# EAGLE design debug-port-breakout (EAGLE 9.6.1)
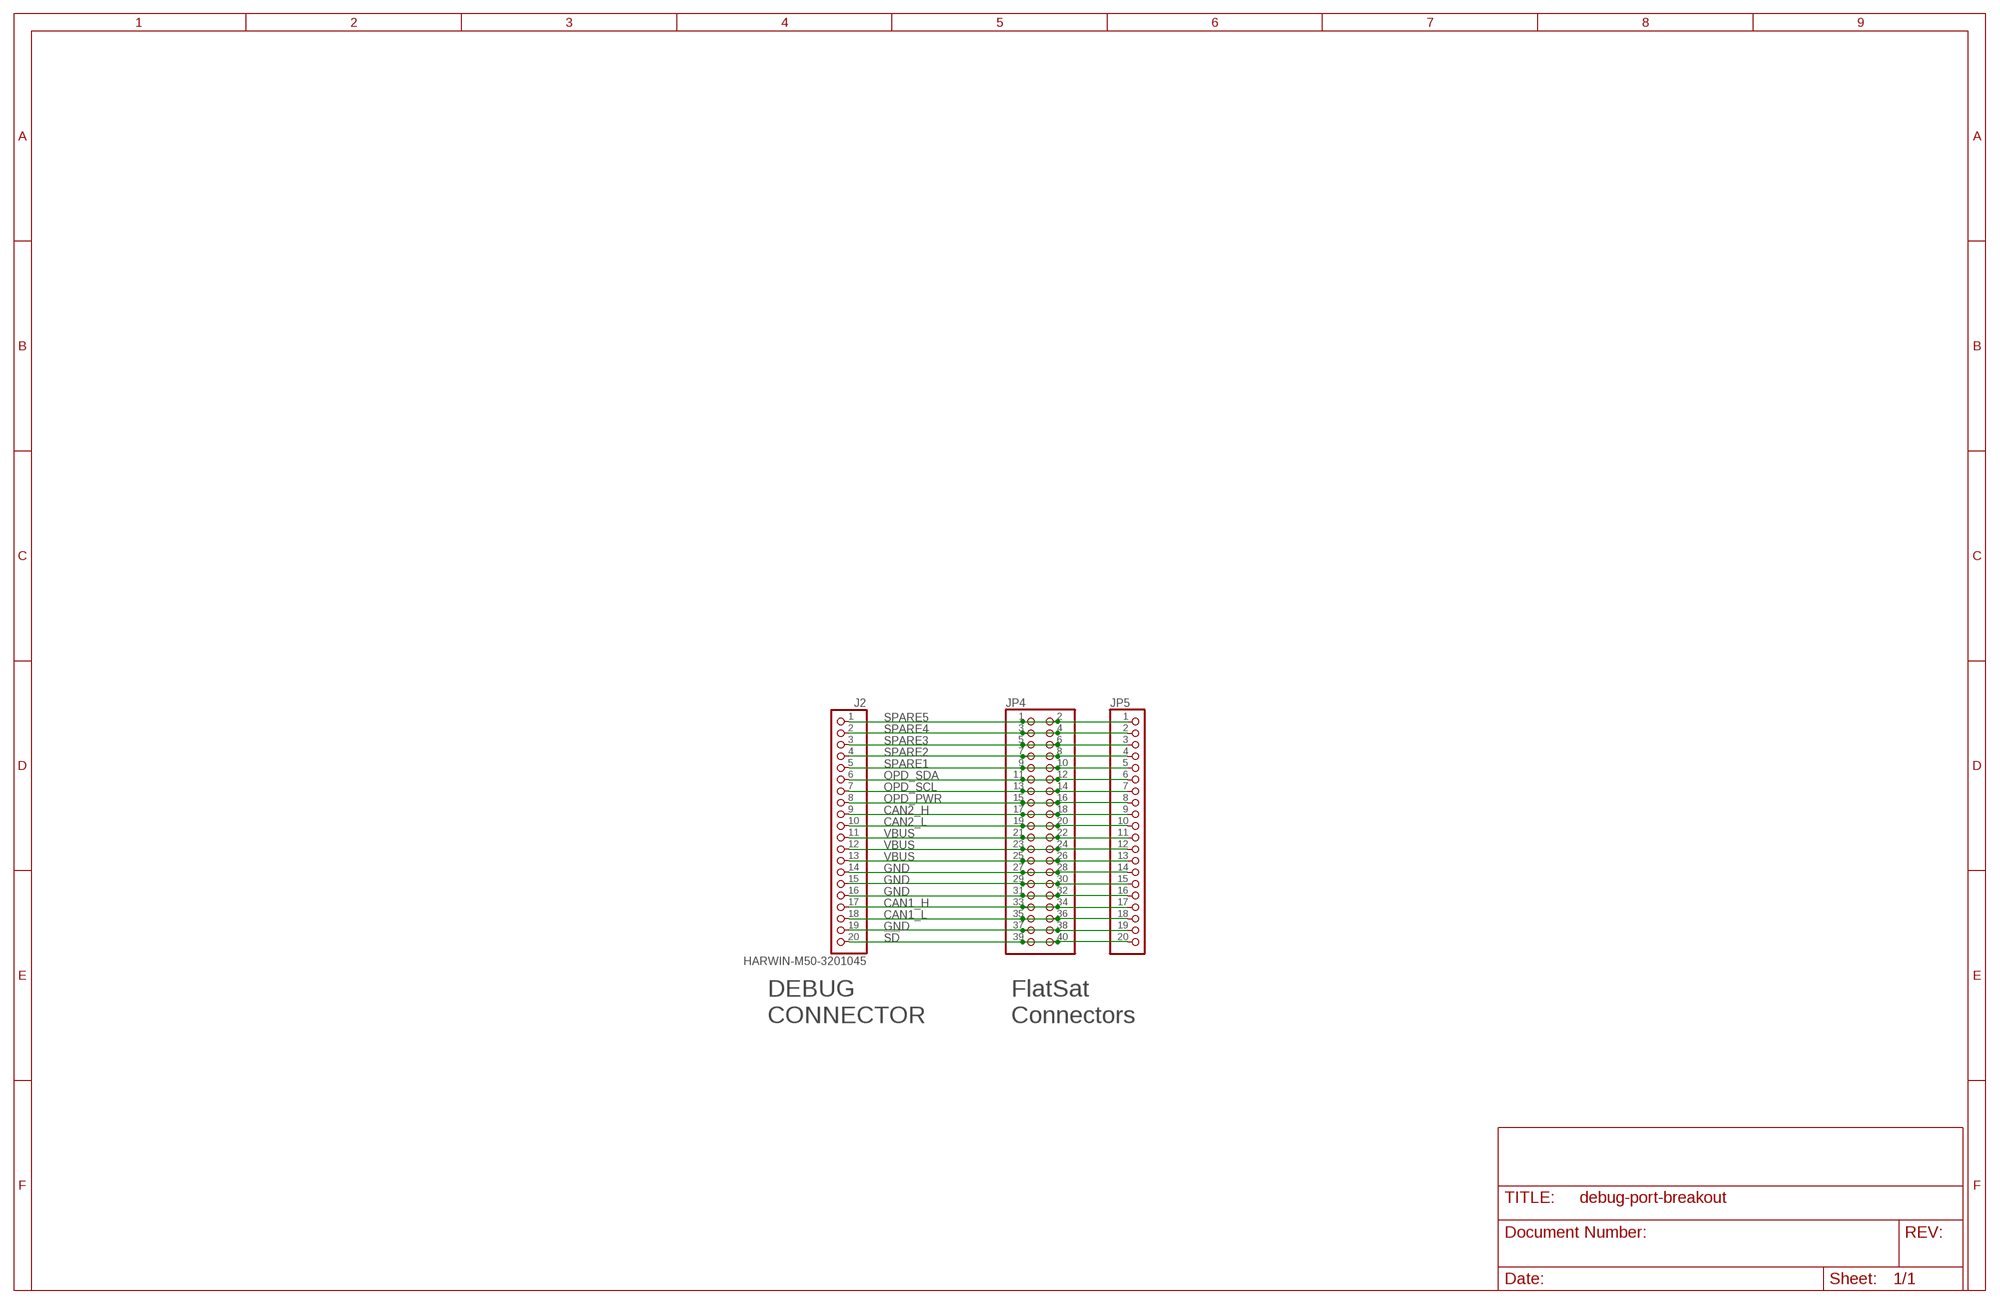
[diagram p0: schematic, sheet 1]

## Parts
J2  HARWIN-M50-3201045  [HARWIN-M50-3201045]
JP4  PINHD-2X20  [2X20]
JP5  PINHD-1X20  [1X20]

## Nets
!SD: J2.20 JP4.39 JP4.40 JP5.20
CAN1_H: J2.17 JP4.33 JP4.34 JP5.17
CAN1_L: J2.18 JP4.35 JP4.36 JP5.18
CAN2_H: J2.9 JP4.17 JP4.18 JP5.9
CAN2_L: J2.10 JP4.19 JP4.20 JP5.10
GND: J2.14 J2.15 J2.16 J2.19 JP4.27 JP4.28 JP4.29 JP4.30 JP4.31 JP4.32 JP4.37 JP4.38 JP5.14 JP5.15 JP5.16 JP5.19
OPD_PWR: J2.8 JP4.15 JP4.16 JP5.8
OPD_SCL: J2.7 JP4.13 JP4.14 JP5.7
OPD_SDA: J2.6 JP4.11 JP4.12 JP5.6
SPARE1: J2.5 JP4.9 JP4.10 JP5.5
SPARE2: J2.4 JP4.7 JP4.8 JP5.4
SPARE3: J2.3 JP4.5 JP4.6 JP5.3
SPARE4: J2.2 JP4.3 JP4.4 JP5.2
SPARE5: J2.1 JP4.1 JP4.2 JP5.1
VBUS: J2.11 J2.12 J2.13 JP4.21 JP4.22 JP4.23 JP4.24 JP4.25 JP4.26 JP5.11 JP5.12 JP5.13

## Notes on the sheet
- DEBUG
  CONNECTOR
- FlatSat
  Connectors

## Library data of the parts
J2 = J-Harwin-M50-3201045-20pin-1.27-F-right-angle-th:HARWIN-M50-3201045
JP4 = pinhead:PINHD-2X20: PIN HEADER
JP5 = pinhead:PINHD-1X20: PIN HEADER

## Board
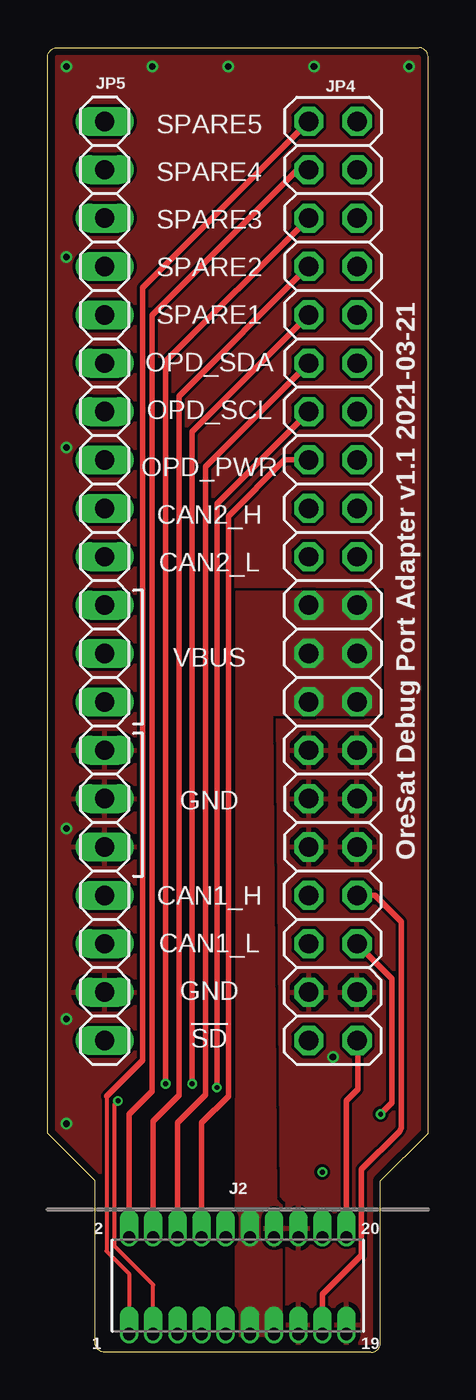
[diagram p1: board, top side]
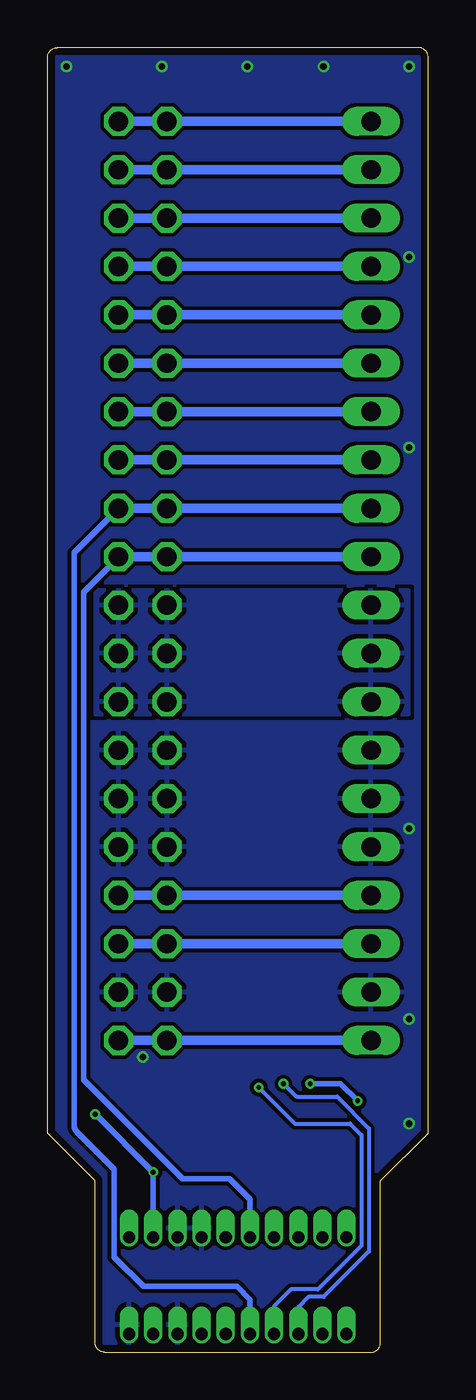
[diagram p2: board, bottom side, seen from below]

Size 20 x 68.5 mm. Coordinates in mm from the lower left corner, seen from the top.
Outline: 17,0 3,0 arc-90 2.5,0.5 2.5,9 0,11.5 0,68 arc-90 0.5,68.5 19.5,68.5 arc-90 20,68 20,11.5 17.5,9 17.5,0.5 arc-90 17,0
Copper layers (1*16): Top 0.035559375mm / dielectric 1.6mm / Bottom 0.035559375mm
Design rules "oshpark-2layer-tented": minimum track width 6mil, minimum drill 10mil, track to track 6mil, track to pad 6mil, pad to pad 6mil, via to via 6mil, smd to smd 6mil, copper to edge 15mil, drill to drill 6mil, minimum pad ring 5mil, minimum via ring 5mil, stop-mask expansion 2.5mil, vias tented up to drill 20mil, thermal gap 10mil

### Footprints (pad centres in the part's own frame; a part is rotated, then mirrored left to right if it is on the bottom)
HARWIN-M50-3201045 = drill 0.635 pad 0.965 offset: 1 5.715,2.54; 2 5.715,-2.54; 3 4.445,2.54; 4 4.445,-2.54; 5 3.175,2.54; 6 3.175,-2.54; 7 1.905,2.54; 8 1.905,-2.54; 9 0.635,2.54; 10 0.635,-2.54; 11 -0.635,2.54; 12 -0.635,-2.54; 13 -1.905,2.54; 14 -1.905,-2.54; 15 -3.175,2.54; 16 -3.175,-2.54; 17 -4.445,2.54; 18 -4.445,-2.54; 19 -5.715,2.54; 20 -5.715,-2.54
2X20 = drill 1.016 octagon: 1 -24.13,-1.27; 2 -24.13,1.27; 3 -21.59,-1.27; 4 -21.59,1.27; 5 -19.05,-1.27; 6 -19.05,1.27; 7 -16.51,-1.27; 8 -16.51,1.27; 9 -13.97,-1.27; 10 -13.97,1.27; 11 -11.43,-1.27; 12 -11.43,1.27; 13 -8.89,-1.27; 14 -8.89,1.27; 15 -6.35,-1.27; 16 -6.35,1.27; 17 -3.81,-1.27; 18 -3.81,1.27; 19 -1.27,-1.27; 20 -1.27,1.27; 21 1.27,-1.27; 22 1.27,1.27; 23 3.81,-1.27; 24 3.81,1.27; 25 6.35,-1.27; 26 6.35,1.27; 27 8.89,-1.27; 28 8.89,1.27; 29 11.43,-1.27; 30 11.43,1.27; 31 13.97,-1.27; 32 13.97,1.27; 33 16.51,-1.27; 34 16.51,1.27; 35 19.05,-1.27; 36 19.05,1.27; 37 21.59,-1.27; 38 21.59,1.27; 39 24.13,-1.27; 40 24.13,1.27
1X20 = drill 1.016 long: 1 -24.13,0; 2 -21.59,0; 3 -19.05,0; 4 -16.51,0; 5 -13.97,0; 6 -11.43,0; 7 -8.89,0; 8 -6.35,0; 9 -3.81,0; 10 -1.27,0; 11 1.27,0; 12 3.81,0; 13 6.35,0; 14 8.89,0; 15 11.43,0; 16 13.97,0; 17 16.51,0; 18 19.05,0; 19 21.59,0; 20 24.13,0

### Placement (x,y rotation side)
J2  10,3.5 180 top
JP4  15,40.5 270 top
JP5  3,40.5 270 top

### Tracks (layer width: path | path; a pad name or v marks a point on that pad's centre or on a via)
!SD
  Top 0.3: J2.20 15.71,13.21 16.3,13.8 16.3,16.34 JP4.40
  Bottom 0.5: JP4.40 JP4.39 JP5.20
CAN1_H
  Top 0.3: J2.17 14.45,3.04 16.5,5.1 16.5,9.6 18.45,11.55 arc45 18.6,11.91 18.6,22.6 17.2,24 JP4.34
  Bottom 0.5: JP4.34 JP4.33 JP5.17
CAN1_L  (via drill 0.25)
  Top 0.3: JP4.36 18.1,19.62 18.1,13.1 v17.5,12.5
  Bottom 0.2: 17.48,12.5 v17.5,12.5
  Bottom 0.3: J2.18 v14.45,9.46 17.48,12.5
  Bottom 0.5: JP4.36 JP4.35 JP5.18
CAN2_H
  Bottom 0.3: J2.9 9.35,0.97 9.35,2.75 10.05,3.46 14.96,3.46 16.5,5 16.5,9.6 18.45,11.55 arc45 18.6,11.91 18.6,41.98 JP4.18
  Bottom 0.5: JP4.18 JP4.17 JP5.9
CAN2_L
  Bottom 0.3: J2.10 9.37,8.04 10.43,9.1 12.9,9.1 18.1,14.3 18.1,39.9 16.27,41.73 JP4.20
  Bottom 0.5: JP4.20 JP4.19 JP5.10
GND  (via drill 0.35)
  other vias: 14,67.5 19,67.5 9.5,67.5 1,67.5 1,12 5.5,67.5 15,15.5 1,57.5 1,47.5 1,27.5 1,17.5
  pour Top (rank 6): 2.5,0 2.5,9 0.02,11.48 0,68.5 20,68.5 20,11.5 17.5,9 17.5,0
  pour Bottom (isolate 0.2, rank 6): 17.5,0 17.5,9 20,11.5 20,68.5 0,68.5 0.02,11.48 2.5,9 2.5,0
OPD_PWR
  Top 0.3: J2.8 8.1,12.04 9.5,13.45 9.5,43.9 12.45,46.85 JP4.15
  Bottom 0.5: JP4.16 JP4.15 JP5.8
OPD_SCL  (via drill 0.25)
  Top 0.3: JP4.13 8.9,44.56 v8.9,13.9
  Bottom 0.2: v8.9,13.9 7,12 4.1,12 3.5,11.4 3.5,5.6 5.8,3.3 7.2,3.3 8.1,2.4 J2.7
  Bottom 0.5: JP4.14 JP4.13 JP5.7
OPD_SDA
  Top 0.3: J2.6 6.83,12.04 8.3,13.52 8.3,46.5 JP4.11
  Bottom 0.5: JP4.12 JP4.11 JP5.6
SPARE1  (via drill 0.25)
  Top 0.3: JP4.9 7.6,48.34 v7.6,14.1
  Bottom 0.2: v7.6,14.1 6.92,13.42 4.78,13.42 3.1,11.74 3.1,5.3 5.49,2.91 6.29,2.91 6.83,2.38 J2.5
  Bottom 0.5: JP4.10 JP4.9 JP5.5
SPARE2
  Top 0.3: J2.4 5.55,12.14 6.9,13.48 6.9,50.2 13.71,57.01 JP4.7
  Bottom 0.5: JP4.8 JP4.7 JP5.4
SPARE3  (via drill 0.25)
  Top 0.152: v3.7,13.2 3.5,13
  Top 0.2: J2.3 5.55,3.54 3.5,5.6 3.5,13
  Top 0.3: v6.2,14.1 6.2,52.02 JP4.5
  Bottom 0.3: v6.2,14.1 4.6,14.1 v3.7,13.2
  Bottom 0.5: JP4.6 JP4.5 JP5.3
SPARE4
  Top 0.3: J2.2 4.29,12.49 5.5,13.7 5.5,54.46 13.13,62.09 JP4.3
  Bottom 0.5: JP4.4 JP4.3 JP5.2
SPARE5
  Top 0.2: 3.1,13.44 3.1,5.32 4.29,4.13 J2.1
  Top 0.3: JP4.1 5,55.9 5,15.34 3.1,13.44
  Bottom 0.5: JP4.2 JP4.1 JP5.1
VBUS
  pour Bottom (isolate 0.2): 1,40 17.5,40 17.5,33.5 1,33.5
  pour Top (isolate 0.2, no thermals): 9.9,0.9 11.9,0.9 12,1 12.3,1 12.3,7.7 12,8 11.8,33.5 17.5,33.5 17.5,39.9 9.9,39.9

### Text on the board
tPlace: SPARE5 | SPARE4 | SPARE3 | SPARE2 | SPARE1 | OPD_SDA | OPD_SCL | OPD_PWR | CAN2_H | CAN2_L | OreSat Debug Port Adapter v1.1 2021-03-21 | VBUS | GND | CAN1_H | CAN1_L | GND | !SD
tDocu: Solar panel top